# EAGLE design Preamp_board1 (EAGLE 9.1.2)
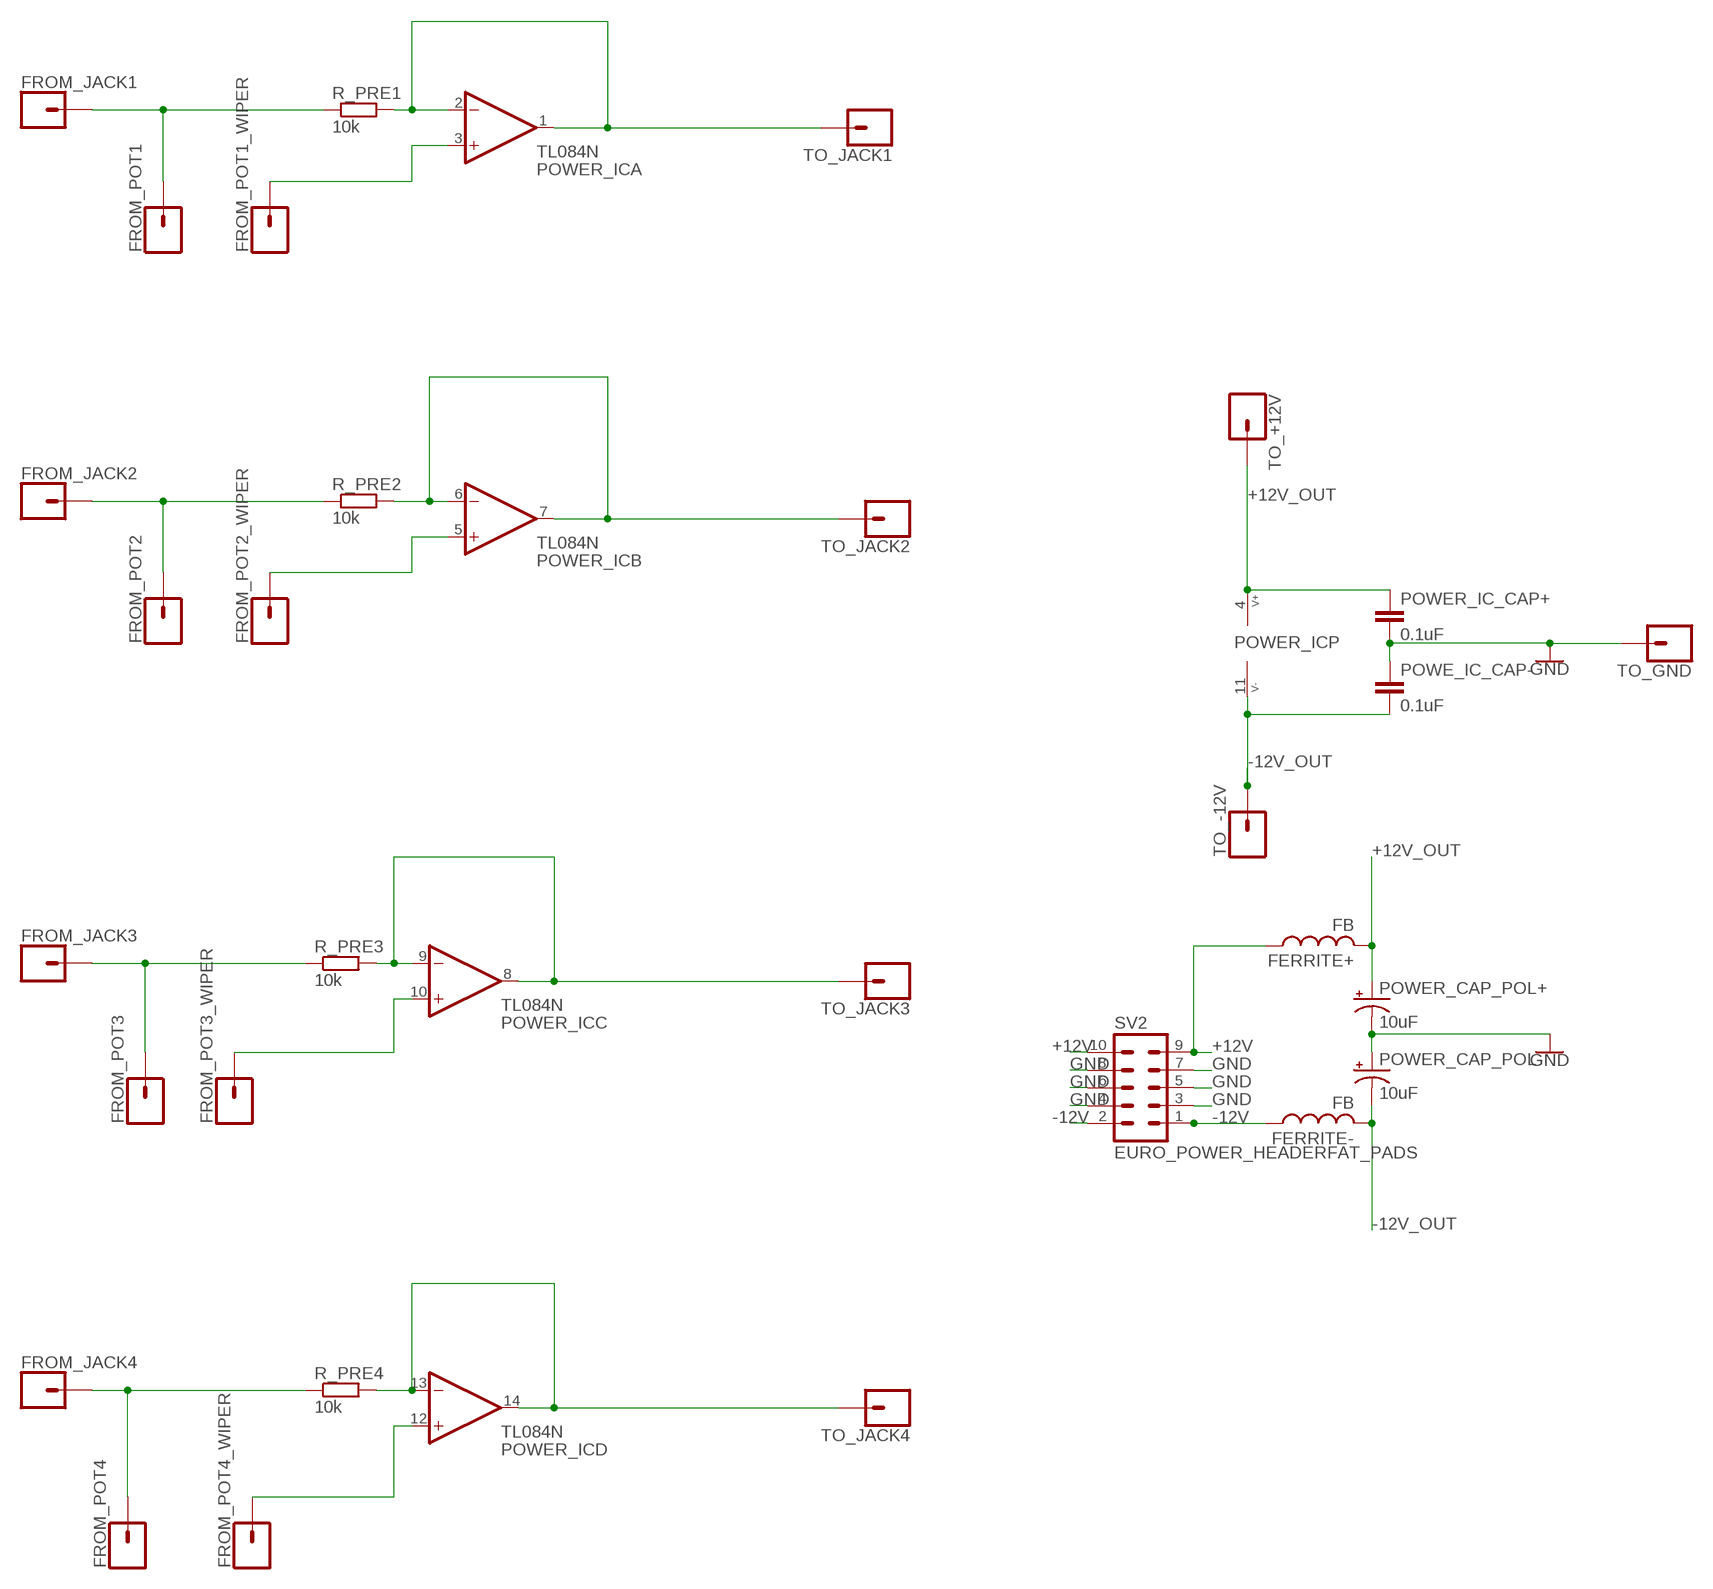
[diagram p0: schematic, sheet 1]

## Parts
FERRITE+  FB  [FB]
FERRITE-  FB  [FB]
FROM_JACK1  CONN_01PTH_LONGPAD  [1X01_LONGPAD]
FROM_JACK2  CONN_01PTH_LONGPAD  [1X01_LONGPAD]
FROM_JACK3  CONN_01PTH_LONGPAD  [1X01_LONGPAD]
FROM_JACK4  CONN_01PTH_LONGPAD  [1X01_LONGPAD]
FROM_POT1  CONN_01PTH_LONGPAD  [1X01_LONGPAD]
FROM_POT1_WIPER  CONN_01PTH_LONGPAD  [1X01_LONGPAD]
FROM_POT2  CONN_01PTH_LONGPAD  [1X01_LONGPAD]
FROM_POT2_WIPER  CONN_01PTH_LONGPAD  [1X01_LONGPAD]
FROM_POT3  CONN_01PTH_LONGPAD  [1X01_LONGPAD]
FROM_POT3_WIPER  CONN_01PTH_LONGPAD  [1X01_LONGPAD]
FROM_POT4  CONN_01PTH_LONGPAD  [1X01_LONGPAD]
FROM_POT4_WIPER  CONN_01PTH_LONGPAD  [1X01_LONGPAD]
POWE_IC_CAP-  0.1uF  0.1UF-KIT-EZ-50V-20%  [CAP-PTH-SMALL-KIT]
POWER_CAP_POL+  10uF  10UF-POLAR-RADIAL-2.5MM-25V-20%  [CPOL-RADIAL-2.5MM-5MM]
POWER_CAP_POL-  10uF  10UF-POLAR-RADIAL-2.5MM-25V-20%  [CPOL-RADIAL-2.5MM-5MM]
POWER_IC  TL084N  [DIL14]
POWER_IC_CAP+  0.1uF  0.1UF-KIT-EZ-50V-20%  [CAP-PTH-SMALL-KIT]
R_PRE1  10k  RESISTOR7MM  [7MM_RESISTOR]
R_PRE2  10k  RESISTOR7MM  [7MM_RESISTOR]
R_PRE3  10k  RESISTOR7MM  [7MM_RESISTOR]
R_PRE4  10k  RESISTOR7MM  [7MM_RESISTOR]
SV2  EURO_POWER_HEADERFAT_PADS  [EURO_PWR_HEADER_FAT]
TO_+12V  CONN_01PTH_LONGPAD  [1X01_LONGPAD]
TO_-12V  CONN_01PTH_LONGPAD  [1X01_LONGPAD]
TO_GND  CONN_01PTH_LONGPAD  [1X01_LONGPAD]
TO_JACK1  CONN_01PTH_LONGPAD  [1X01_LONGPAD]
TO_JACK2  CONN_01PTH_LONGPAD  [1X01_LONGPAD]
TO_JACK3  CONN_01PTH_LONGPAD  [1X01_LONGPAD]
TO_JACK4  CONN_01PTH_LONGPAD  [1X01_LONGPAD]

## Nets
+12V: FERRITE+.P$1 SV2.9 SV2.10
+12V_OUT: FERRITE+.P$2 POWER_CAP_POL+.1(+) POWER_IC.4(P:V+) POWER_IC_CAP+.1 TO_+12V.1
-12V: FERRITE-.P$1 SV2.1 SV2.2
-12V_OUT: FERRITE-.P$2 POWE_IC_CAP-.2 POWER_CAP_POL-.2(-) POWER_IC.11(P:V-) TO_-12V.1
GND: POWE_IC_CAP-.1 POWER_CAP_POL+.2(-) POWER_CAP_POL-.1(+) POWER_IC_CAP+.2 SV2.3 SV2.4 SV2.5 SV2.6 SV2.7 SV2.8 TO_GND.1
N$2: POWER_IC.13(D:-IN) POWER_IC.14(D:OUT) R_PRE4.2 TO_JACK4.1
N$4: FROM_JACK3.1 FROM_POT3.1 R_PRE3.1
N$5: FROM_JACK1.1 FROM_POT1.1 R_PRE1.1
N$6: POWER_IC.1(A:OUT) POWER_IC.2(A:-IN) R_PRE1.2 TO_JACK1.1
N$7: POWER_IC.6(B:-IN) POWER_IC.7(B:OUT) R_PRE2.2 TO_JACK2.1
N$9: FROM_JACK2.1 FROM_POT2.1 R_PRE2.1
N$11: FROM_JACK4.1 FROM_POT4.1 R_PRE4.1
N$13: FROM_POT1_WIPER.1 POWER_IC.3(A:+IN)
N$17: FROM_POT2_WIPER.1 POWER_IC.5(B:+IN)
N$18: FROM_POT3_WIPER.1 POWER_IC.10(C:+IN)
N$19: FROM_POT4_WIPER.1 POWER_IC.12(D:+IN)
N$21: POWER_IC.8(C:OUT) POWER_IC.9(C:-IN) R_PRE3.2 TO_JACK3.1

## Library data of the parts
FERRITE+ FERRITE- = adafruit:FB: Ferrite bead Digikey #P9821BK-ND
FROM_JACK1-FROM_JACK4 FROM_POT1 FROM_POT1_WIPER FROM_POT2 FROM_POT2_WIPER FROM_POT3 FROM_POT3_WIPER FROM_POT4 FROM_POT4_WIPER TO_+12V TO_-12V TO_GND TO_JACK1-TO_JACK4 = SparkFun-Connectors:CONN_01: Single connection point. Often used as Generic Header-pin footprint for 0.1 inch spaced/style header connections On any of the 0.1 inch spaced packages, you can populate with these: Break Away Headers - Straight <https://www.sparkfun.com/products/116> (PRT-00116) Break Away Male Headers - Right Angle <https://www.sparkfun.com/products/553> (PRT-00553) Female Headers <https://www.sparkfun.com/products/115> (PRT-00115) Break Away Headers - Machine Pin <https://www.sparkfun.com/products/117> (PRT-00117) Break Away Female Headers - Swiss Machine Pin <https://www.sparkfun.com/products/743> (PRT-00743) This device is also useful as a general connection point to wire up your design to another part of your project. Our various solder wires solder well into these plated through hole pads. Hook-Up Wire - Assortment (Stranded, 22 AWG) <https://www.sparkfun.com/products/11375> (PRT-11375) Hook-Up Wire - Assortment (Solid Core, 22 AWG) <https://www.sparkfun.com/products/11367> (PRT-11367) View the entire wire category on our website here <https://www.sparkfun.com/categories/141> Special notes: SMTSO-256-ET is a "flush mount" nut for a 4-40 screw. We mostly use this on specialty testbeds; it is a nice way to connect hardware to your PCB at an adjustable hieght. Also note, the SNAP packages are for using a snappable style connector. We sell a baggie of snaps and they are also used on two LilyPad designs: Snap Assortment - 30 pack (male and female) <https://www.sparkfun.com/products/11347> (DEV-11347) LilyPad Arduino SimpleSnap <https://www.sparkfun.com/products/10941> (DEV-10941) LilyPad SimpleSnap Protoboard <https://www.sparkfun.com/products/10940> (DEV-10940)
POWE_IC_CAP- POWER_IC_CAP+ = SparkFun-Capacitors:0.1UF: 0.1µF ceramic capacitors A capacitor is a passive two-terminal electrical component used to store electrical energy temporarily in an electric field.; PROD_ID: CAP-08370
POWER_CAP_POL+ POWER_CAP_POL- = SparkFun-Capacitors:10UF-POLAR: 10.0µF polarized capacitors A capacitor is a passive two-terminal electrical component used to store electrical energy temporarily in an electric field.; PROD_ID: CAP-08440
POWER_IC = op-amp:TL084: JFET OP-AMP - Quad
R_PRE1-R_PRE4 = MusicThingModular:RESISTOR: Standard resistor, various versions
SV2 = MusicThingModular:EURO_POWER_HEADER: Power Header 10 pin power header for Eurorack Power Supplies Variants with fatter pads for easier soldering, and the LOCK variant which has 5mil offset pins to hold the component in place before soldering

## Board
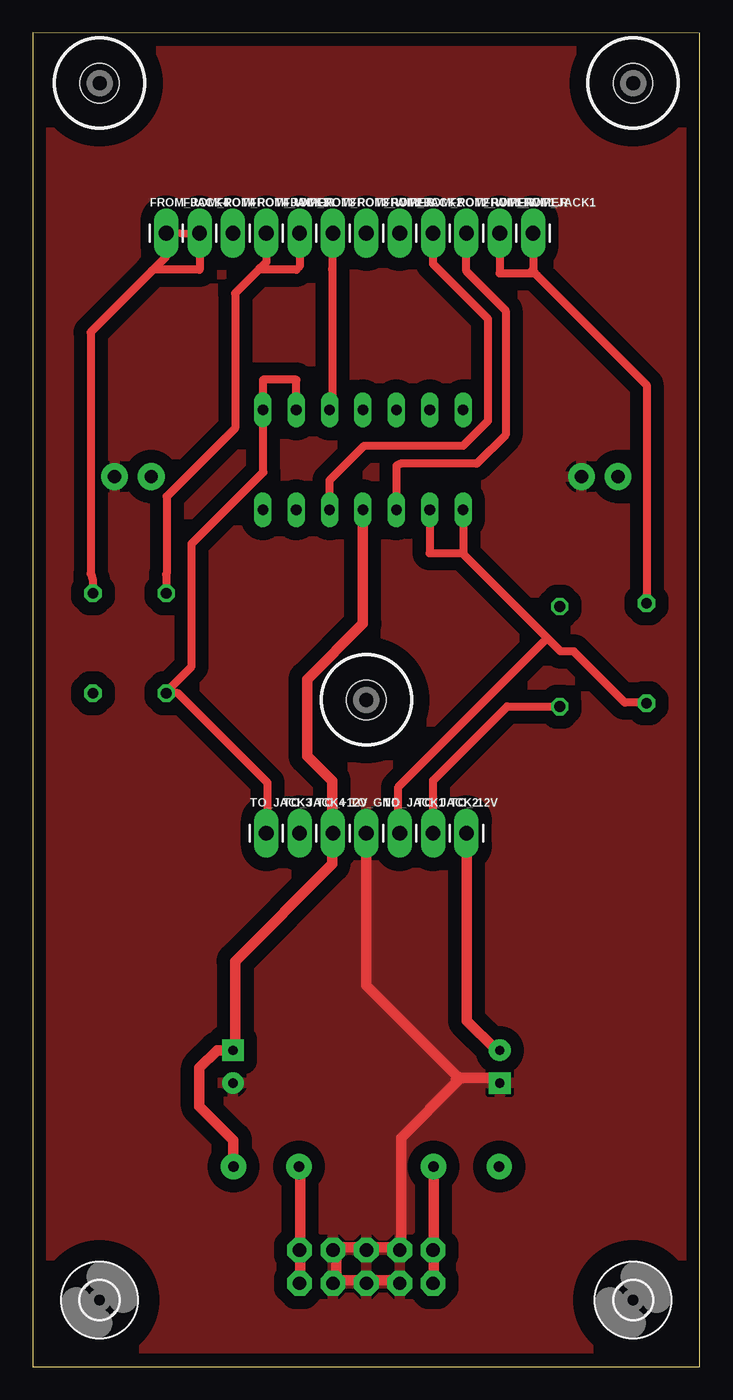
[diagram p1: board, top side]
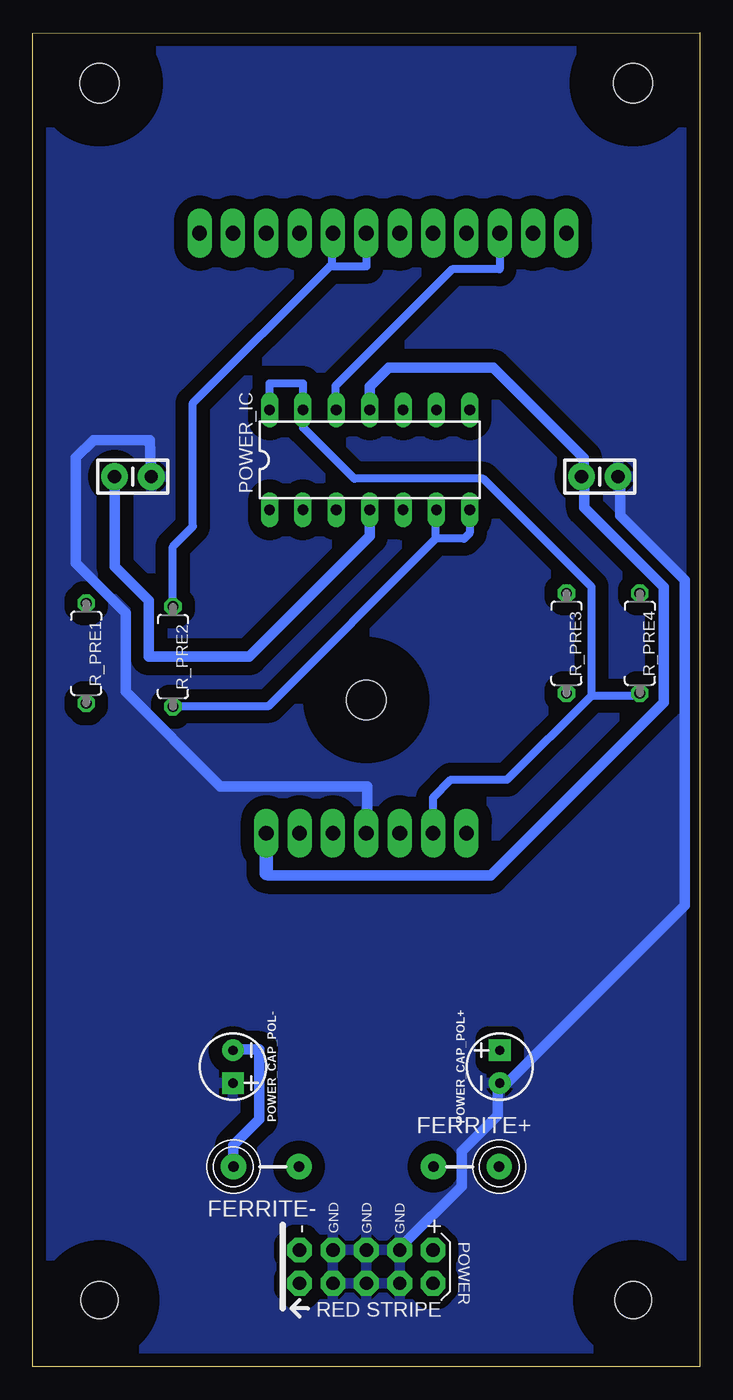
[diagram p2: board, bottom side, seen from below]

Size 50.8 x 101.62 mm. Coordinates in mm from the lower left corner, seen from the top.
Outline: 0,0 50.8,0 50.8,101.6 0,101.62 0,0
Copper layers (1*16): Top 0.035mm / dielectric 1.5mm / Bottom 0.035mm
Design rules "default *": minimum track width 0.6mm, minimum drill 0.35mm, track to track 0.5mm, track to pad 0.5mm, pad to pad 6mil, via to via 6mil, smd to smd 6mil, copper to edge 0.5mm, drill to drill 0.5mm, minimum pad ring 10mil, minimum via ring 8mil, stop-mask expansion 4mil, vias tented up to drill 0mil, thermal gap 10mil

### Footprints (pad centres in the part's own frame; a part is rotated, then mirrored left to right if it is on the bottom)
FB = drill 0.8 pad 1.93: P$1 -2.5,0; P$2 2.5,0
1X01_LONGPAD = drill 1.118 pad 1.88 long: 1 0,0
DRIL-3 = hole 3: 0,0
CAP-PTH-SMALL-KIT = drill 1.016 pad 2.032: 1 -1.397,0; 2 1.397,0
CPOL-RADIAL-2.5MM-5MM = drill 0.7 pad 1.651 square: 1 1.25,0 | drill 0.7 pad 1.651: 2 -1.25,0
DIL14 = drill 0.813 long: 1 -7.62,-3.81; 2 -5.08,-3.81; 3 -2.54,-3.81; 4 0,-3.81; 5 2.54,-3.81; 6 5.08,-3.81; 7 7.62,-3.81; 8 7.62,3.81; 9 5.08,3.81; 10 2.54,3.81; 11 0,3.81; 12 -2.54,3.81; 13 -5.08,3.81; 14 -7.62,3.81
7MM_RESISTOR = drill 0.813 octagon: 1 -3.81,0; 2 3.81,0
EURO_PWR_HEADER_FAT = drill 1.016 pad 1.88 octagon: 1 -5.08,-1.27; 2 -5.08,1.27; 3 -2.54,-1.27; 4 -2.54,1.27; 5 0,-1.27; 6 0,1.27; 7 2.54,-1.27; 8 2.54,1.27; 9 5.08,-1.27; 10 5.08,1.27
2,8 = hole 2.8: 0,0

### Placement (x,y rotation side)
FERRITE+  17.78,15.24 0 bottom
FERRITE-  33.02,15.24 180 bottom
FROM_JACK1  38.1,86.36 0 top
FROM_JACK2  27.94,86.36 0 top
FROM_JACK3  17.78,86.36 0 top
FROM_JACK4  10.16,86.36 0 top
FROM_POT1  35.56,86.36 0 top
FROM_POT1_WIPER  33.02,86.36 0 top
FROM_POT2  25.4,86.36 0 top
FROM_POT2_WIPER  30.48,86.36 0 top
FROM_POT3  20.32,86.36 0 top
FROM_POT3_WIPER  22.86,86.36 0 top
FROM_POT4  12.7,86.36 0 top
FROM_POT4_WIPER  15.24,86.36 0 top
H1  [DRIL-3]  5.08,97.79 0 top
H2  [DRIL-3]  45.72,97.79 0 top
H4  [DRIL-3]  25.4,50.8 0 top
POWE_IC_CAP-  7.62,67.82 180 bottom
POWER_CAP_POL+  15.24,22.86 90 bottom
POWER_CAP_POL-  35.56,22.86 270 bottom
POWER_IC  25.15,69.09 0 bottom
POWER_IC_CAP+  43.18,67.82 0 bottom
R_PRE1  46.74,54.36 270 bottom
R_PRE2  40.13,54.1 270 bottom
R_PRE3  10.16,55.12 270 bottom
R_PRE4  4.57,55.12 270 bottom
SV2  25.4,7.62 0 bottom
TO_+12V  22.86,40.64 0 top
TO_-12V  33.02,40.64 0 top
TO_GND  25.4,40.64 0 top
TO_JACK1  27.94,40.64 0 top
TO_JACK2  30.48,40.64 0 top
TO_JACK3  17.78,40.64 0 top
TO_JACK4  20.32,40.64 0 top
U$1  [2,8]  5.08,5.08 0 top
U$2  [2,8]  45.72,5.08 0 top

### Tracks (layer width: path | path; a pad name or v marks a point on that pad's centre or on a via)
+12V
  Top 0.6: 20.35,6.6 SV2.9 | 20.35,8.8 SV2.10 20.35,9.35 | 20.35,14.85 FERRITE+.P$1
  Top 0.813: 20.35,8.8 20.35,6.6 | 20.35,9.35 20.35,14.85
+12V_OUT
  Top 0.6: 15.4,24.2 POWER_CAP_POL+.1 | 22.8,40.55 TO_+12V.1
  Top 0.813: POWER_IC.4 25.15,56.61 20.9,52.36 20.9,46.54 22.8,44.64 22.8,40.65 TO_+12V.1 | 15.4,24.2 15.4,30.88 22.8,38.29 22.8,40.55 | POWER_CAP_POL+.1 14.04,24.11 12.69,22.76 12.69,19.84 15.28,17.26 FERRITE+.P$2
  Bottom 0.6: 44.55,67.65 POWER_IC_CAP+.1
  Bottom 0.813: 44.55,67.65 44.55,60.97 41.95,58.37 41.95,54.1 34.32,54.1 25.15,63.28 POWER_IC.4
-12V
  Top 0.6: 30.55,6.4 SV2.1 | 30.55,8.87 SV2.2 30.55,8.98 | 30.55,14.6 30.52,14.63 FERRITE-.P$1
  Top 0.813: 30.55,8.87 30.55,6.4 | 30.55,8.98 30.55,14.6
-12V_OUT
  Top 0.6: 33.02,39.11 33.04,39.13 | 35.2,24.2 POWER_CAP_POL-.2
  Top 0.813: 33.04,39.13 33.04,26.36 35.2,24.2 | 33.02,39.11 TO_-12V.1
  Bottom 0.6: 8.8,67.65 POWE_IC_CAP-.2
  Bottom 0.813: 8.8,67.65 8.8,65.45 2.75,59.4 2.75,50.6 15.91,37.44 32.87,37.44 33.02,37.59 | POWER_IC.11 25.15,74.68 23.71,76.12 15.74,76.12 8.84,69.22 8.84,67.99 POWE_IC_CAP-.2 | FERRITE-.P$2 35.52,16.86 33.55,18.83 33.55,24.16 35.51,24.16 POWER_CAP_POL-.2
  Bottom 1.016: 33.02,37.59 TO_-12V.1
GND
  Top 0.6: 28.05,9.35 SV2.4 27.74,9.1 | 25.6,9.1 SV2.6 25.36,9.1 | 25.85,6.6 SV2.5 25.3,6.6 | 23.1,8.8 SV2.8 23.08,9.11 23.1,9.1 | 23.1,6.6 SV2.7 23.1,6.6
  Top 0.813: 28.05,9.35 28.05,17.43 32.23,21.61 | 27.74,9.1 25.6,9.1 | TO_GND.1 25.4,29.03 32.25,22.19 32.4,22.04 | 32.58,21.96 32.45,22.09 32.4,22.04 | 25.85,6.6 27.5,6.6 SV2.3 | 23.1,8.8 23.1,6.6 25.3,6.6 | 23.1,9.1 25.36,9.1 | 32.23,21.61 32.63,22.01 35.16,22.01 POWER_CAP_POL-.1 | 32.23,21.61 32.23,21.87 32.4,22.04
  Bottom 0.6: 15.4,21.45 POWER_CAP_POL+.2 14.85,21.45 | 22.55,9.35 SV2.8 | 6.05,67.65 POWE_IC_CAP-.1 | TO_GND.1 25.34,40.7
  Bottom 0.813: 25.34,40.7 25.34,44.21 36.51,44.21 43.73,51.43 43.73,57.44 47.51,61.22 47.51,69.26 46.16,70.61 41.91,70.61 POWER_IC_CAP+.2 | 15.4,21.45 15.4,19.17 18.15,16.42 18.15,13.75 22.55,9.35 | 6.05,67.65 6.05,64.86 1.14,59.95 1.14,35.16 14.85,21.45
  pour Top (isolate 1): 0,0 0,101.6 50.8,101.6 50.8,0
  pour Bottom (isolate 1): 0,0 0,101.6 0.1,101.5 50.8,101.5 50.9,101.4 50.9,0
N$1
  pour Top (isolate 1): 0.1,74.5 0.1,43.7 -0.1,43.5 50.6,43.5 51,43.9 51,74.5 50.9,74.6 0.2,74.6
N$2
  Bottom 0.6: 8.25,51.15 4.95,51.15 R_PRE4.2 | 8.25,51.15 14.68,44.72 18.95,44.72 20.31,43.37 20.31,40.64 TO_JACK4.1 | 8.25,51.15 8.25,59.4 16.5,67.65 26.32,67.65 30.21,71.54 30.21,72.89 POWER_IC.13
  Bottom 0.61: POWER_IC.14 32.77,74.93 30.23,74.93 POWER_IC.13
N$3
  pour Top (isolate 1): 0,84.1 0,75.4 -0.1,75.3 50.9,75.3 50.9,84.7 50.8,84.8 0.3,84.8 0.1,84.6
N$4
  Top 0.6: 17.6,83.98 17.19,83.57 17.1,83.48 15.4,81.78 15.4,71.5 10.2,66.3 10.2,60.42 10.16,60.36 R_PRE3.1
  Top 0.61: FROM_POT3.1 20.32,83.82 20.07,83.57 17.19,83.57 17.1,83.48 | FROM_JACK3.1 17.78,84.16 17.6,83.98
N$5
  Top 0.6: 38.1,83.45 38.42,83.13 46.75,74.8 46.75,58.3 R_PRE1.1
  Top 0.61: FROM_POT1.1 35.56,83.31 37.85,83.31 | 37.85,83.31 38.24,83.31 38.42,83.13 | FROM_JACK1.1 38.1,83.57 37.85,83.31
N$6
  Top 0.6: 45.1,50.6 46.2,50.6 R_PRE1.2 | 39.18,55.51 40.19,54.49 | 39.18,55.51 27.8,44.13 27.8,40.78 TO_JACK1.1 | 32.75,61.94 39.18,55.51
  Top 0.61: 45.1,50.6 41.21,54.49 40.19,54.49 | POWER_IC.2 30.23,61.98 32.71,61.98 | 32.71,61.98 32.75,61.94 | POWER_IC.1 32.77,62.03 32.71,61.98
N$7
  Top 0.6: TO_JACK2.1 30.48,44.66 36.12,50.3 40.12,50.3 R_PRE2.2
  Bottom 0.6: 20.1,63.08 32.83,50.35 40.04,50.35 R_PRE2.2
  Bottom 0.61: POWER_IC.6 20.1,65.25 20.1,63.08 17.95,63.08 17.53,63.5 POWER_IC.7
N$8
  pour Bottom (isolate 1): 0.3,83.7 50.9,83.7 50.9,36.4 51.1,36.2 0.5,36.2 0,36.2
N$9
  Bottom 0.6: 38.62,73.41 28.2,83.83 28.05,83.98 28.05,86.35 FROM_JACK2.1
  Bottom 0.61: FROM_POT2.1 25.4,83.82 25.41,83.83 28.2,83.83 | R_PRE2.1 40.13,62.48 38.61,64.01 38.61,73.41 38.62,73.41
N$11
  Top 0.6: FROM_POT4.1 12.33,86.28 FROM_JACK4.1 10.16,84.58 9.02,83.44 4.4,78.82 4.4,60.42 4.57,59.94 R_PRE4.1
  Top 0.61: FROM_POT4.1 12.7,83.57 9.15,83.57 9.02,83.44
N$13
  Top 0.6: POWER_IC.3 27.69,68.64 28,68.79 33.8,68.79 36,70.99 36,80.47 33.02,83.45 FROM_POT1_WIPER.1
N$17
  Top 0.6: POWER_IC.5 22.59,65.29 22.59,67.52 25.21,70.15 32.75,70.15 34.65,72.05 34.65,79.83 30.48,84 FROM_POT2_WIPER.1
N$18
  Top 0.6: FROM_POT3_WIPER.1 22.8,86.3 22.8,83.61 22.8,73.1 POWER_IC.10
N$19
  Bottom 0.6: FROM_POT4_WIPER.1 15.24,83.6 18.87,83.6 27.75,74.72 27.75,72.97 POWER_IC.12
N$21
  Top 0.6: POWER_IC.8 17.56,72.87 17.56,68.16 12.1,62.7 12.1,53.35 10.45,51.7 R_PRE3.2 11.06,51.31 17.85,44.51 17.85,40.71 TO_JACK3.1
  Top 0.61: POWER_IC.9 20.07,75.18 17.53,75.18 POWER_IC.8

### Text on the board
tDocu: A0 | A7 | 5.5V | GND | D2 | D4 | D7
bDocu: A4 | D13 | 3.3V | AREF | A0 | A1 | A2 | A3 | A4 | A5 | A6 | A7 | 5.5V | RST | GND | RAW | D12 | D11 | D10 | D9 | D8 | D7 | D6 | D5 | D4 | D3 | D2 | GND | RST1 | RX1 | TX0